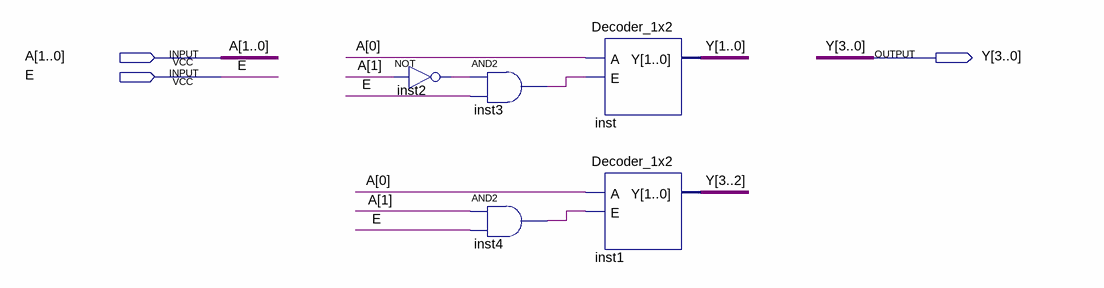
[diagram p0: schematic sheet]
// Quartus schematic Decoder_2x4.bdf as structural Verilog: 5 symbols, 3 pins
module Decoder_2x4 (
  input  [1:0] A,
  input  E,
  output [3:0] Y
);

  wire inst2_out, inst3_out, inst4_out;

  not inst2 (inst2_out, A[1]);
  and inst3 (inst3_out, inst2_out, E);
  and inst4 (inst4_out, A[1], E);
  Decoder_1x2 inst (.A(A[0]), .E(inst3_out), .Y(Y[1:0]));
  Decoder_1x2 inst1 (.A(A[0]), .E(inst4_out), .Y(Y[3:2]));
endmodule
